# Altium schematic sheet Watch-Sheet.SchDoc
size A4
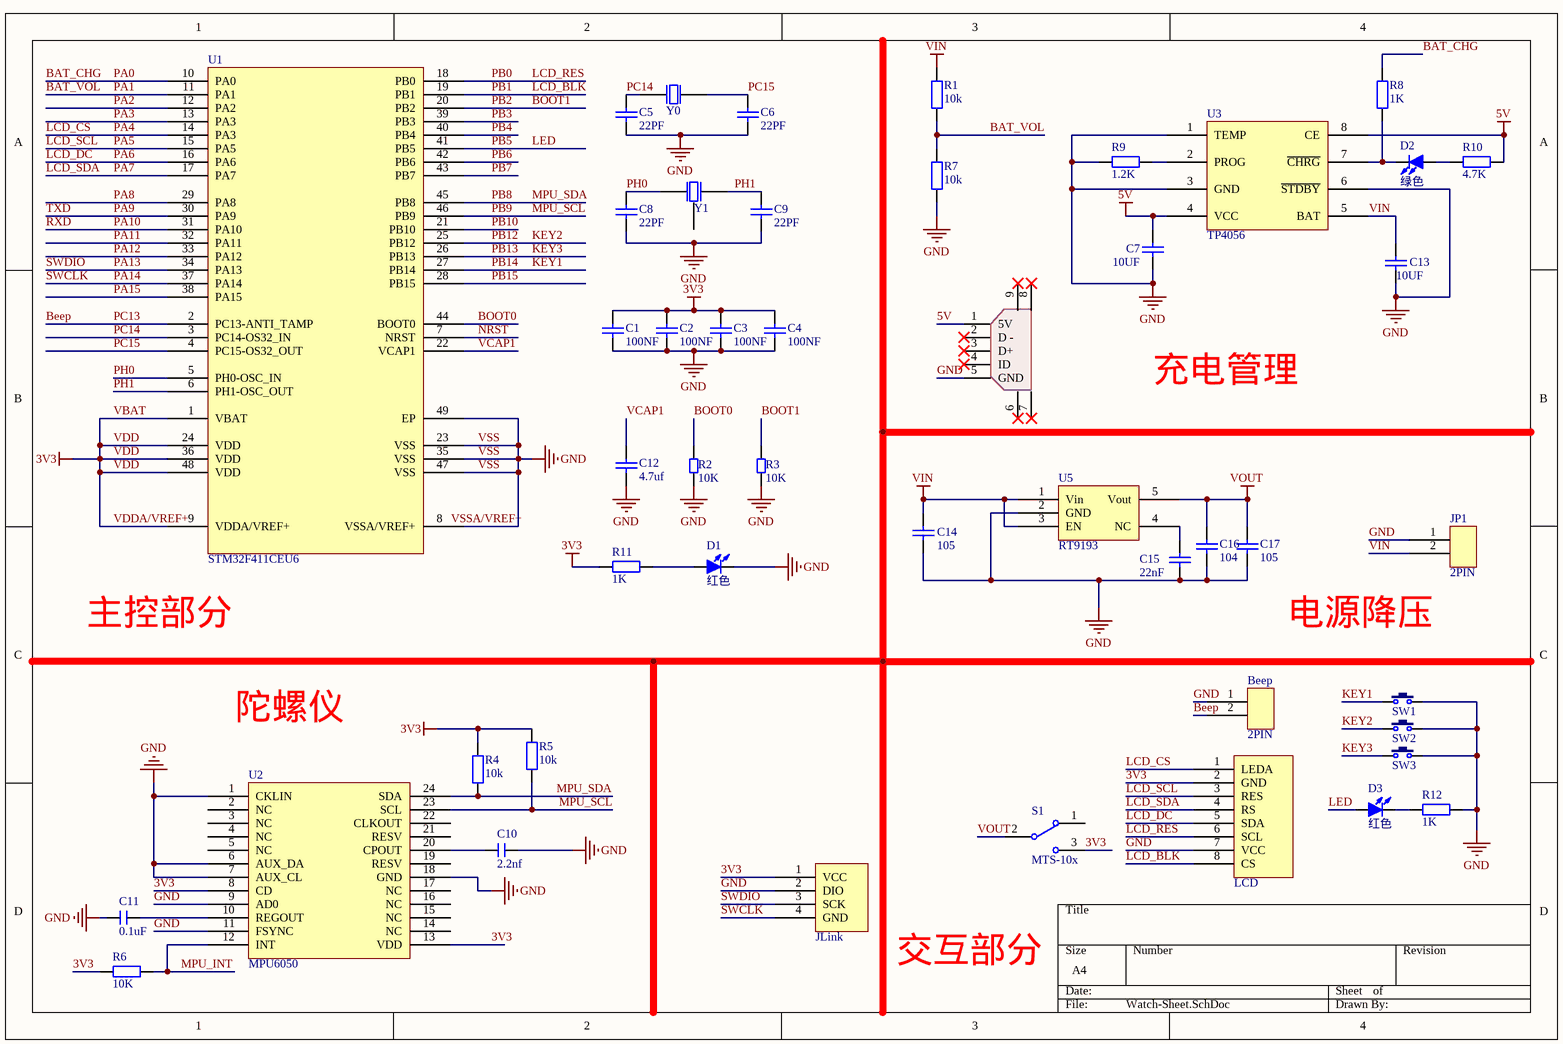
[diagram p0: Watch-Sheet.SchDoc]

## Parts
?  Micro USB  [USB-micro_A]  (value not drawn)
Beep  2PIN  [5020beep]
C1  100NF  [C 0603_M]
C2  100NF  [C 0603_M]
C3  100NF  [C 0603_M]
C4  100NF  [C 0603_M]
C5  22PF  [C 0603_M]
C6  22PF  [C 0603_M]
C7  10UF  [C 0603_M]
C8  22PF  [C 0603_M]
C9  22PF  [C 0603_M]
C10  2.2nf  [C 0603_M]
C11  0.1uF  [C 0603_M]
C12  value 4.7uf  [C 0603_M]  (hidden comment: Cap Chip 0603)
C13  10UF  [C 0603_M]
C14  105  [C 0603_M]
C15  22nF  [C 0603_M]
C16  104  [C 0603_M]
C17  105  [C 0603_M]
D1  红色  [LED 0603R]
D2  绿色  [LED 0603R]
D3  红色  [LED 0603R]
JP1  2PIN  [2PIN]
R1  10k  [R 0603_M]
R2  10K  [R 0603_M]
R3  10K  [R 0603_M]
R4  10k  [R 0603_M]
R5  10k  [R 0603_M]
R6  10K  [R 0603_M]
R7  10k  [R 0603_M]
R8  1K  [R 0603_M]
R9  1.2K  [R 0603_M]
R10  4.7K  [R 0603_M]
R11  1K  [R 0603_M]
R12  1K  [R 0603_M]
S1  MTS-10x  [MSK-12C01-07]
SW1  3x6x5  [TSW 3*6*4.3-S-W]  (value not drawn)
SW2  3x6x5  [TSW 3*6*4.3-S-W]  (value not drawn)
SW3  3x6x5  [TSW 3*6*4.3-S-W]  (value not drawn)
U1  STM32F411CEU6  [QFN48 7X7_M]
U2  MPU6050  [QFN24]
U3  TP4056  [SOP8]
U4  LCD  [FPC0.5 2H-WS-8P]
U5  RT9193  [SOT23-5]
U14  JLink  [JLink]
Y0  XTAL 3215 32.768kKHz  [OSC 3215-2P]  (value not drawn)
Y1  XTAL 3225 8M  [OSC 3225-4P]  (value not drawn)

## Nets
3V3: C1.2 C2.2 C3.2 C4.2 R4.2 R5.2 R6.1 R11.1 S1.3 U1.1(VBAT) U1.9(VDDA/VREF+) U1.24(VDD) U1.36(VDD) U1.48(VDD) U2.8(CD) U2.13(VDD) U4.2(GND) U14.1(VCC)  [also labelled VBAT, VDD, VDDA/VREF+]
5V: ?.1(5V) C7.2 R10.2 U3.4(VCC) U3.8(CE)
GND: ?.5(GND) Beep.1 C1.1 C2.1 C3.1 C4.1 C5.1 C6.1 C7.1 C8.1 C9.1 C10.2 C11.1 C12.1 C13.1 C14.1 C15.1 C16.2 C17.2 D1.2(K) JP1.1 R2.1 R3.1 R7.1 R9.1 R12.2 SW1.2 SW2.2 SW3.2 U1.8(VSSA/VREF+) U1.23(VSS) U1.35(VSS) U1.47(VSS) U1.49(EP) U2.1(CKLIN) U2.6(AUX_DA) U2.7(AUX_CL) U2.9(AD0) U2.11(FSYNC) U2.18(GND) U3.1(TEMP) U3.3(GND) U3.6(~{STDB}~{Y}) U4.7(VCC) U5.2(GND) U14.2(DIO)  [also labelled VSS]
VIN: C13.2 C14.2 JP1.2 R1.2 U3.5(BAT) U5.1(Vin) U5.3(EN)
VOUT: C16.1 C17.1 S1.2 U5.5(Vout)
BAT_CHG: R8.2 U1.10(PA0)  [also labelled PA0]
BAT_VOL: R1.1 R7.2 U1.11(PA1)  [also labelled PA1]
Beep: Beep.2 U1.2(PC13-ANTI_TAMP)  [also labelled PC13]
BOOT0: R2.2 U1.44(BOOT0)
BOOT1: R3.2 U1.20(PB2)  [also labelled PB2]
KEY1: SW1.1 U1.27(PB14)  [also labelled PB14]
KEY2: SW2.1 U1.25(PB12)  [also labelled PB12]
KEY3: SW3.1 U1.26(PB13)  [also labelled PB13]
LCD_BLK: U1.19(PB1) U4.8(CS)  [also labelled PB1]
LCD_CS: U1.14(PA3) U4.1(LEDA)  [also labelled PA4]
LCD_DC: U1.16(PA6) U4.5(SDA)  [also labelled PA6]
LCD_RES: U1.18(PB0) U4.6(SCL)  [also labelled PB0]
LCD_SCL: U1.15(PA5) U4.3(RES)  [also labelled PA5]
LCD_SDA: U1.17(PA7) U4.4(RS)  [also labelled PA7]
LED: D3.1(A) U1.41(PB5)  [also labelled PB5]
MPU_INT: R6.2 U2.12(INT)
MPU_SCL: R5.1 U1.46(PB9) U2.23(SCL)  [also labelled PB9]
MPU_SDA: R4.1 U1.45(PB8) U2.24(SDA)  [also labelled PB8]
NRST: U1.7(NRST)
PA2: U1.12(PA2)
PA3: U1.13(PA3)
PA8: U1.29(PA8)
PA9: U1.30(PA9)  [also labelled TXD]
PA10: U1.31(PA10)  [also labelled RXD]
PA11: U1.32(PA11)
PA12: U1.33(PA12)
PA13: U1.34(PA13) U14.3(SCK)  [also labelled SWDIO]
PA14: U1.37(PA14) U14.4(GND)  [also labelled SWCLK]
PA15: U1.38(PA15)
PB3: U1.39(PB3)
PB4: U1.40(PB4)
PB6: U1.42(PB6)
PB7: U1.43(PB7)
PB10: U1.21(PB10)
PB15: U1.28(PB15)
PC14: C5.2 U1.3(PC14-OS32_IN) Y0.1(OSC1)
PC15: C6.2 U1.4(PC15-OS32_OUT) Y0.2(OSC2)
PH0: C8.2 U1.5(PH0-OSC_IN) Y1.1(OSC1)
PH1: C9.2 U1.6(PH1-OSC_OUT) Y1.2(OSC2)
VCAP1: C12.2 U1.22(VCAP1)
NetC10_1: C10.1 U2.20(CPOUT)
NetC11_2: C11.2 U2.10(REGOUT)
NetC15_2: C15.2 U5.4(NC)
NetD1_1: D1.1(A) R11.2
NetD2_1: D2.1(A) R10.1
NetD2_2: D2.2(K) R8.1 U3.7(~{CHRG})
NetD3_2: D3.2(K) R12.1
NetR9_2: R9.2 U3.2(PROG)

Not connected (* = marked no-connect by the designer): ? 2(D_-)* 3(D+)* 4(ID_)* 6* 7* 8* 9*; S1 1; U2 2(NC) 3(NC) 4(NC) 5(NC) 14(NC) 15(NC) 16(NC) 17(NC) 19(RESV) 21(RESV) 22(CLKOUT); Y1 3(GND)

## Notes on the sheet
- 充电管理
- 主控部分
- 电源降压
- 陀螺仪
- 交互部分
- Labels drawn without touching a wire or pin: VSSA/VREF+

## Library data of the parts
C1-C9 C13-C17 = 0402 CAP
C10 C11 = C: 无极性贴片电容; 版权归属: 源创客; BOM名称: 无极性贴片电容; 学习资源: www.ooocke.com
C12 = Cap Chip 0603: Polarized Capacitor (Radial); Published: 8-Jun-2000; Revision: July-2002: Re-released for DXP Platform.; Publisher: Altium Limited
D1-D3 = LED-SMD: 贴片LED; 版权归属: 源创客; BOM名称: 贴片LED; 学习资源: www.ooocke.com
R1 R4-R12 = R: 贴片电阻; 版权归属: 源创客; BOM名称: 贴片电阻; 学习资源: www.ooocke.com
R2 R3 = 0402 RES
S1 = MTS-10x: MTS10x系列3脚扭子开关; 版权归属: 源创客; BOM名称: MTS10x系列3脚扭子开关; 学习资源: www.ooocke.com
SW1-SW3 = TSW 3x6: 3x6轻触开关; 版权归属: 源创客; BOM名称: 3x6轻触开关; 学习资源: www.ooocke.com
U1 = STM32F401CCU6
U4 = LCD: 屏幕接口
U5 = mic5205